# Altium schematic sheet Serial.SchDoc: Iris
size A3; Organization: Toradex AG; Address1: Altsagenstrasse 5; Address2: Horw; Address3: 6048; Address4: Switzerland; DocumentNumber: 14; Revision: V2.0; SheetNumber: 14; SheetTotal: 16
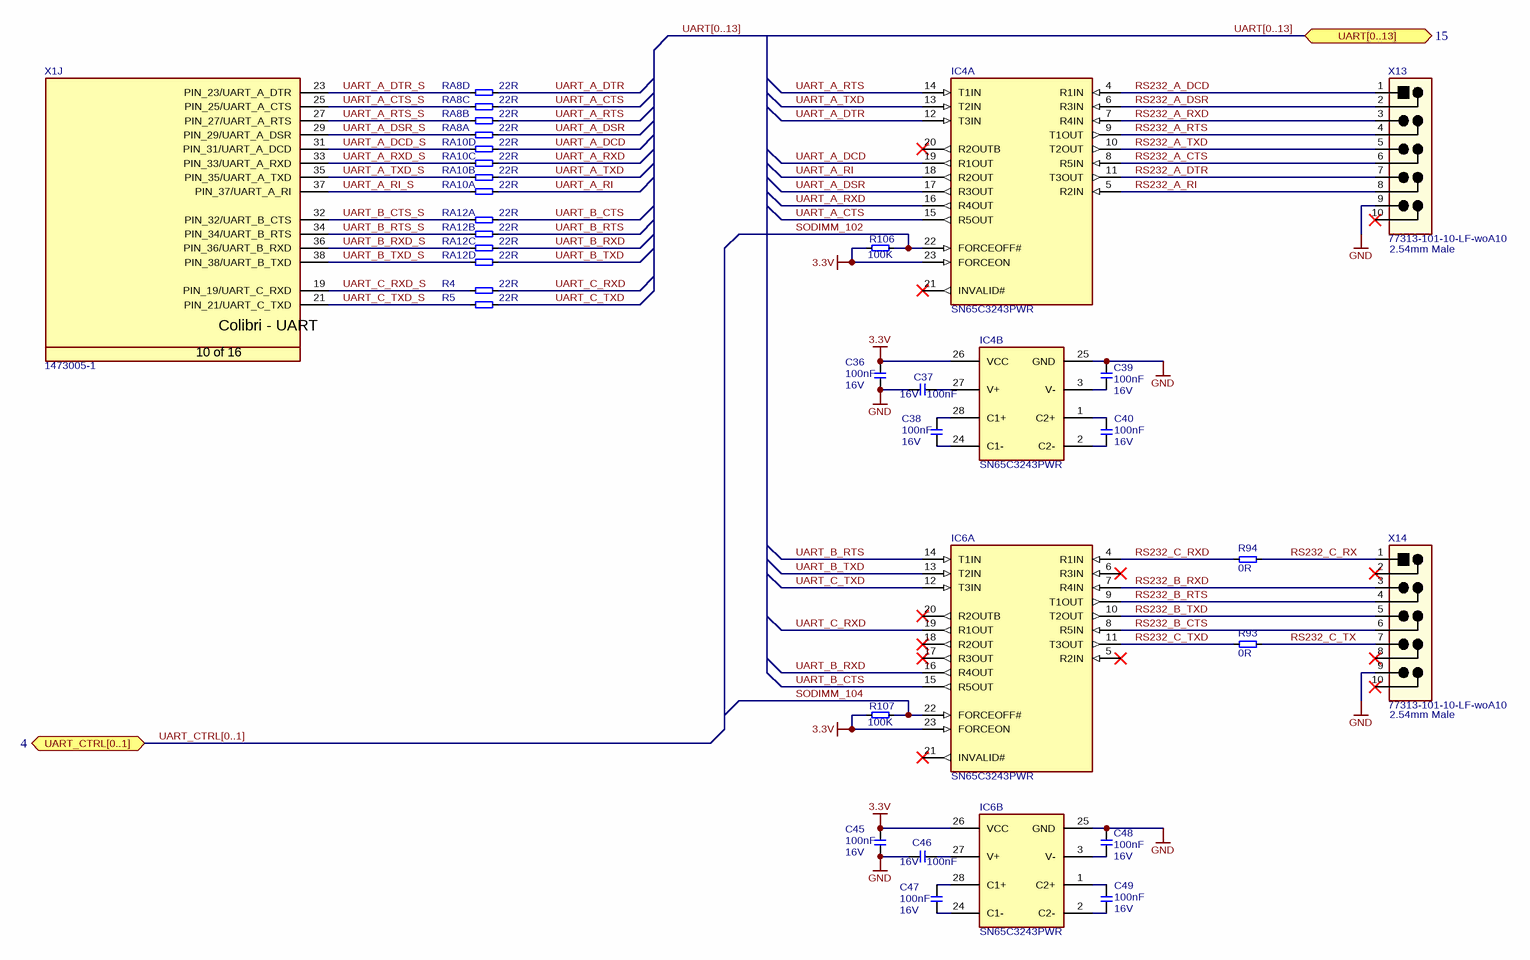
[diagram p0: Serial.SchDoc]

## Parts
C36  Rating: 16V  [CAPC1005X60N]  (hidden comment: 100nF)
C37  Rating: 16V  [CAPC1005X60N]  (hidden comment: 100nF)
C38  Rating: 16V  [CAPC1005X60N]  (hidden comment: 100nF)
C39  Rating: 16V  [CAPC1005X60N]  (hidden comment: 100nF)
C40  Rating: 16V  [CAPC1005X60N]  (hidden comment: 100nF)
C45  Rating: 16V  [CAPC1005X60N]  (hidden comment: 100nF)
C46  Rating: 16V  [CAPC1005X60N]  (hidden comment: 100nF)
C47  Rating: 16V  [CAPC1005X60N]  (hidden comment: 100nF)
C48  Rating: 16V  [CAPC1005X60N]  (hidden comment: 100nF)
C49  Rating: 16V  [CAPC1005X60N]  (hidden comment: 100nF)
IC4  SN65C3243PWR  [SOP65P780X200-28N]  (parts A,B of 2)
IC6  SN65C3243PWR  [SOP65P780X200-28N]  (parts A,B of 2)
R4  22R  [RESC1005X40N]
R5  22R  [RESC1005X40N]
R93  0R  [T_RESC0603X30N]
R94  0R  [T_RESC0603X30N]
R106  100K  [T_RESC0603X30N]
R107  100K  [T_RESC0603X30N]
RA8  22R  [T_Resistor_Array_X4]  (parts A,B,C,D of 4)
RA10  22R  [T_Resistor_Array_X4]  (parts A,B,C,D of 4)
RA12  22R  [T_Resistor_Array_X4]  (parts A,B,C,D of 4)
X1  1473005-1  [T_Tyco_1473005-1]  (part J of 16)
X13  77313-101-10-LF-woA10  [T_FCI_77313-101-10-LF-woA10]
X14  77313-101-10-LF-woA10  [T_FCI_77313-101-10-LF-woA10]

## Ports
UART[0..13] (bidir, see 15), UART_CTRL[0..1] (bidir, see 4)

## Nets
3.3V: C36.2 C45.2 IC4.23(FORCEON) IC4.26(VCC) IC6.23(FORCEON) IC6.26(VCC) R106.1 R107.1
GND: C36.1 C37.1 C39.2 C45.1 C46.1 C48.2 IC4.25(GND) IC6.25(GND) X13.9 X14.9
RS232_A_CTS: IC4.8(R5IN) X13.6
RS232_A_DCD: IC4.4(R1IN) X13.1
RS232_A_DSR: IC4.6(R3IN) X13.2
RS232_A_DTR: IC4.11(T3OUT) X13.7
RS232_A_RI: IC4.5(R2IN) X13.8
RS232_A_RTS: IC4.9(T1OUT) X13.4
RS232_A_RXD: IC4.7(R4IN) X13.3
RS232_A_TXD: IC4.10(T2OUT) X13.5
RS232_B_CTS: IC6.8(R5IN) X14.6
RS232_B_RTS: IC6.9(T1OUT) X14.4
RS232_B_RXD: IC6.7(R4IN) X14.3
RS232_B_TXD: IC6.10(T2OUT) X14.5
RS232_C_RX: R94.2 X14.1
RS232_C_RXD: IC6.4(R1IN) R94.1
RS232_C_TX: R93.2 X14.7
RS232_C_TXD: IC6.11(T3OUT) R93.1
SODIMM_102: IC4.22(FORCEOFF#) R106.2
SODIMM_104: IC6.22(FORCEOFF#) R107.2
UART_A_CTS: IC4.15(R5OUT) RA8.7
UART_A_CTS_S: RA8.3 X1.25(PIN_25/UART_A_CTS)
UART_A_DCD: IC4.19(R1OUT) RA10.8
UART_A_DCD_S: RA10.4 X1.31(PIN_31/UART_A_DCD)
UART_A_DSR: IC4.17(R3OUT) RA8.5
UART_A_DSR_S: RA8.1 X1.29(PIN_29/UART_A_DSR)
UART_A_DTR: IC4.12(T3IN) RA8.8
UART_A_DTR_S: RA8.4 X1.23(PIN_23/UART_A_DTR)
UART_A_RI: IC4.18(R2OUT) RA10.5
UART_A_RI_S: RA10.1 X1.37(PIN_37/UART_A_RI)
UART_A_RTS: IC4.14(T1IN) RA8.6
UART_A_RTS_S: RA8.2 X1.27(PIN_27/UART_A_RTS)
UART_A_RXD: IC4.16(R4OUT) RA10.7
UART_A_RXD_S: RA10.3 X1.33(PIN_33/UART_A_RXD)
UART_A_TXD: IC4.13(T2IN) RA10.6
UART_A_TXD_S: RA10.2 X1.35(PIN_35/UART_A_TXD)
UART_B_CTS: IC6.15(R5OUT) RA12.5
UART_B_CTS_S: RA12.1 X1.32(PIN_32/UART_B_CTS)
UART_B_RTS: IC6.14(T1IN) RA12.6
UART_B_RTS_S: RA12.2 X1.34(PIN_34/UART_B_RTS)
UART_B_RXD: IC6.16(R4OUT) RA12.7
UART_B_RXD_S: RA12.3 X1.36(PIN_36/UART_B_RXD)
UART_B_TXD: IC6.13(T2IN) RA12.8
UART_B_TXD_S: RA12.4 X1.38(PIN_38/UART_B_TXD)
UART_C_RXD: IC6.19(R1OUT) R4.2
UART_C_RXD_S: R4.1 X1.19(PIN_19/UART_C_RXD)
UART_C_TXD: IC6.12(T3IN) R5.2
UART_C_TXD_S: R5.1 X1.21(PIN_21/UART_C_TXD)
NetC37_2: C37.2 IC4.27(V+)
NetC38_1: C38.1 IC4.24(C1-)
NetC38_2: C38.2 IC4.28(C1+)
NetC39_1: C39.1 IC4.3(V-)
NetC40_1: C40.1 IC4.2(C2-)
NetC40_2: C40.2 IC4.1(C2+)
NetC46_2: C46.2 IC6.27(V+)
NetC47_1: C47.1 IC6.24(C1-)
NetC47_2: C47.2 IC6.28(C1+)
NetC48_1: C48.1 IC6.3(V-)
NetC49_1: C49.1 IC6.2(C2-)
NetC49_2: C49.2 IC6.1(C2+)

Not connected (* = marked no-connect by the designer): IC4 20(R2OUTB)* 21(INVALID#)*; IC6 5(R2IN)* 6(R3IN)* 17(R3OUT)* 18(R2OUT)* 20(R2OUTB)* 21(INVALID#)*; X13 10*; X14 2* 8* 10*

## Buses and harness runs
bus UART[0..13] = port UART[0..13]
bus UART_CTRL[0..1] = port UART_CTRL[0..1]

## Notes on the sheet
- (near X13) 2.54mm Male
- (near X14) 2.54mm Male
- Title
- Size:
- Date:
- A3
- Number:
- Time:
- Revision:
- Sheet
- of
- File:
- (in symbol CON-Tyco-1473005-1-200-0.6mm, part J) Colibri - UART; 10 of 16

## Library data of the parts
C36-C40 C45-C49 = C-X7R-100nF-16V-10%-0402: Capacitor Ceramic X7R 100nF 16V 10% 0402; Tolerance: 10%; Type: X7R; Value: 100nF
IC4 IC6 = IC-TI-SN65C3243PWR: RS-232 Serial Transceiver; Manufacturer Name: Texas Instruments; Manufacturer Part No.: SN65C3243PWR
R4 R5 = R-22R-63mW-5%-0402: Resistor 22 ohm 63mW 5% 0402; Rating: 63mW; Tolerance: 5%; Value: 22R
R93 R94 = R-0R-63mW-5%-0603: Resistor 0 ohm 63mW 5% 0603; Tolerance: 5%; Value: 0R; Rating: 63mW; Size: 0603 (In)
R106 R107 = R-100KR-63mW-5%-0603: Resistor 100 Kohm 63mW 5% 0603; Value: 100KR; Rating: 63mW; Tolerance: 5%
RA8 RA10 RA12 = RA-22R-63mW-5%-1206-div: Resistor Array 22 R 63mW 5% 1206; Manufacturer Name: Generic; Tolerance: 5%; Power Dissipation: 63mW; Manufacturer Part Number: *; Value: 22R
X1 = CON-Tyco-1473005-1-200-0.6mm: SODIMM Connector; Manufacturer Name: Tyco; No. of ways: 200; Manufacturer Part No.: 1473005-1
X13 X14 = CON-Fci-77313-101-10-LF-woA10-9-2.54mm: RS232 Header; Manufacturer Name: FCI; No. of ways: 9; Manufacturer Part No.: 77313-101-10-LF-woA10